# EAGLE schematic OPNpool r4 (EAGLE 9.6.2)
REV: 0.1
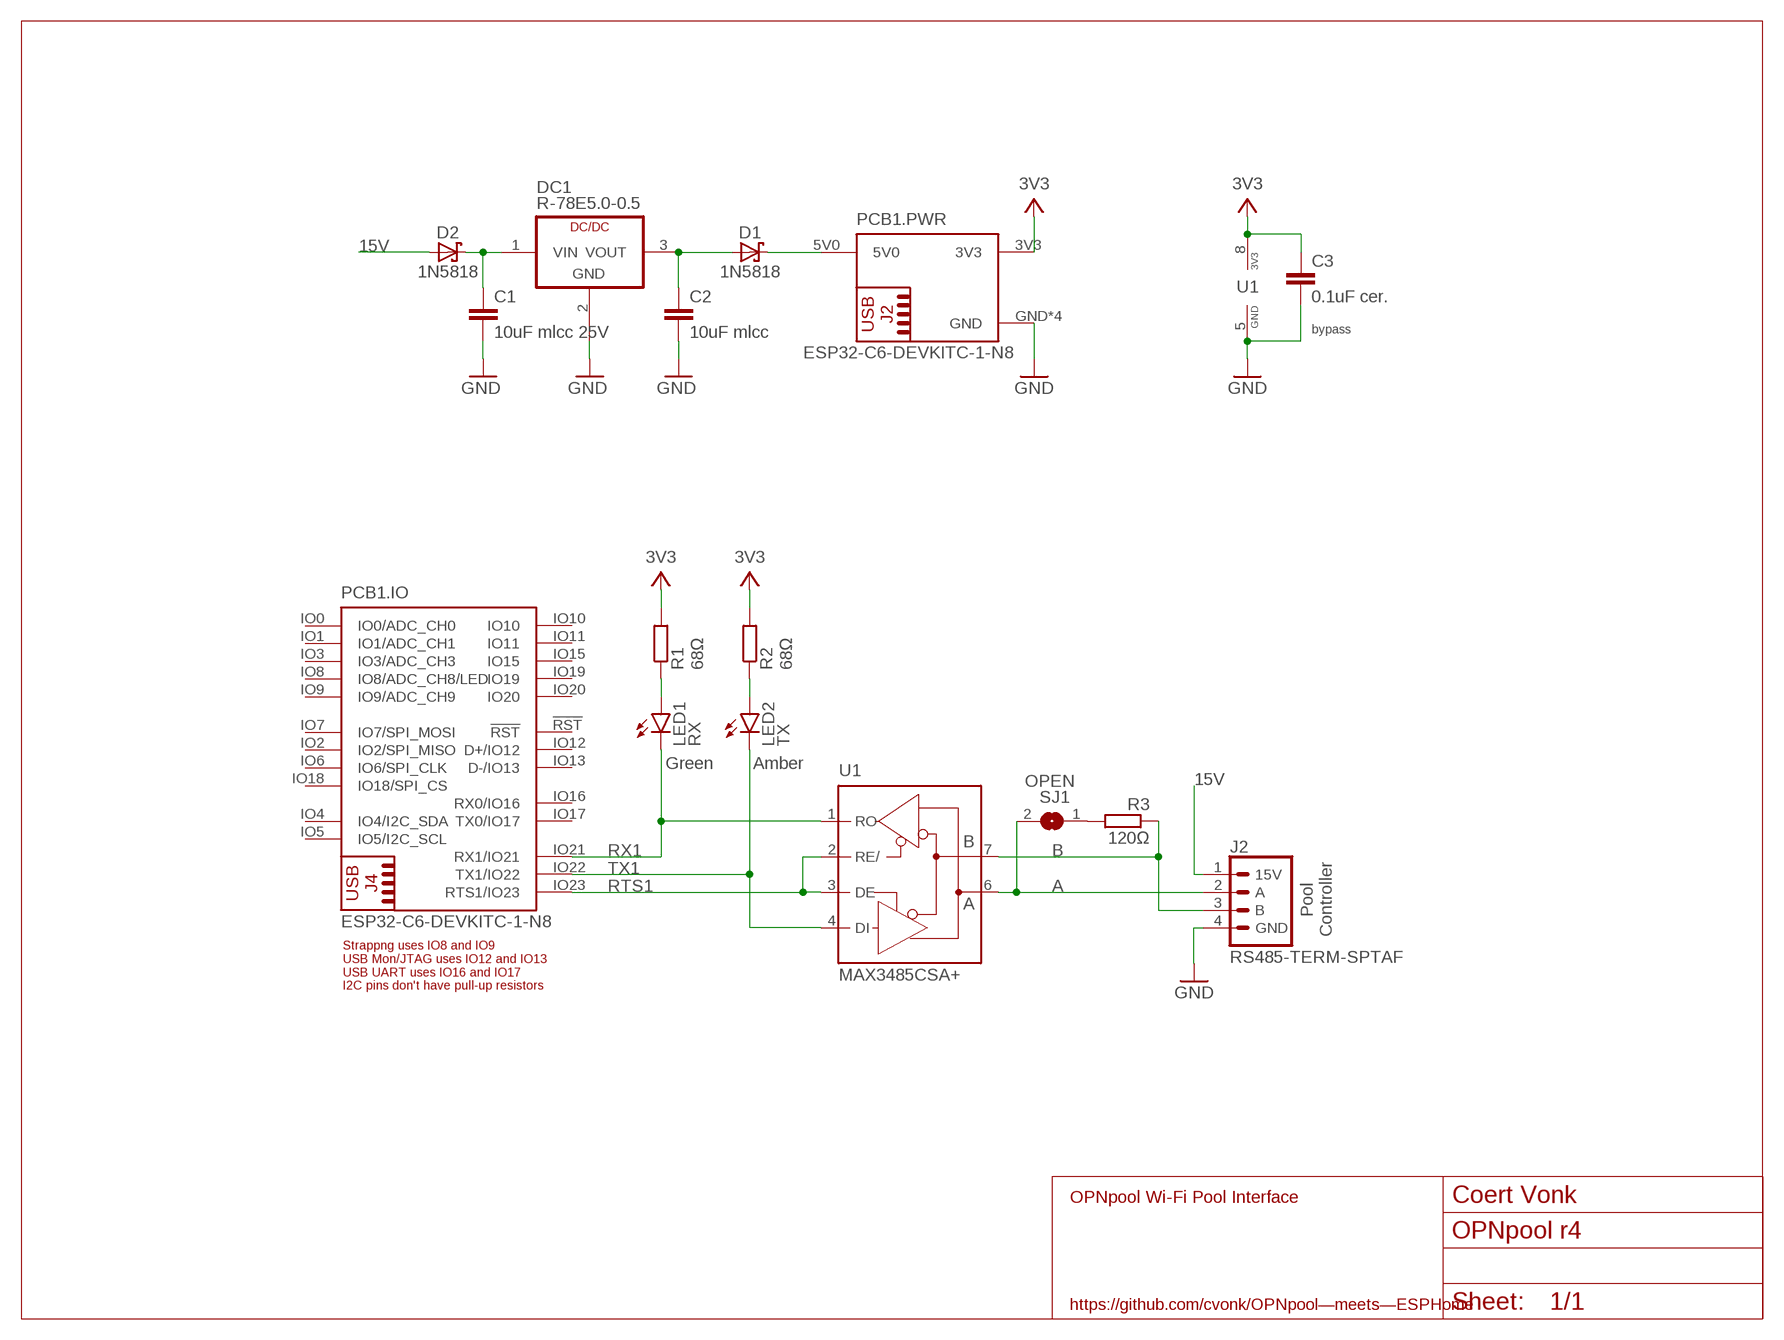
[diagram p0: schematic, sheet 1]
U$1 (FRAME_LETTER_L): AUTHOR_NAME: Coert Vonk; DESCRIPTION: OPNpool Wi-Fi Pool Interface; REV: 3; URL: https://github.com/cvonk/OPNpool—meets—ESPHome

## Parts
C1  10uF mlcc 25V  C-EUC0805K  [C0805K]
C2  10uF mlcc  C-EUC0805K  [C0805K]
C3  0.1uF cer.  C-EUC0805K  [C0805K]
D1  1N5818  [DO41-7.6]
D2  1N5818  [DO41-7.6]
DC1  R-78E5.0-0.5  [SIP3]
J2  RS485-TERM-SPTAF  [SPTAF1/4-5,0-LL]
LED1  RX  LEDCHIPLED_0805  [CHIPLED_0805]
LED2  TX  LEDCHIPLED_0805  [CHIPLED_0805]
PCB1  ESP32-C6-DEVKITC-1-N8  [MODULE_ESP32-C6-DEVKITC-1-N8]
R1  68Ω  R-EU_R0805  [R0805]
R2  68Ω  R-EU_R0805  [R0805]
R3  120Ω  R-EU_R0805  [R0805]
SJ1  OPEN  SJ  [SJ]
U1  MAX3485CSA+  [SO08]

## Nets
3V3: C3.1 PCB1.3V3(.PWR:3V3) R1.2 R2.2 U1.8(P:VCC)
15V: D2.A J2.1(15V)
A: J2.2(A) SJ1.2 U1.6(A)
B: J2.3(B) R3.1 U1.7(B)
GND: C1.2 C2.2 C3.2 DC1.2(GND) J2.4(GND) PCB1.GND(.PWR:GND) PCB1.GND@1(.PWR:GND) PCB1.GND@2(.PWR:GND) PCB1.GND@3(.PWR:GND) U1.5(P:GND)
N$1: LED1.A R1.1
N$2: LED2.A R2.1
N$4: D1.C PCB1.5V0(.PWR:5V0)
N$5: R3.2 SJ1.1
RTS1: PCB1.IO23(.IO:RTS1/IO23) U1.2(RE/) U1.3(DE)
RX1: LED1.C PCB1.IO21(.IO:RX1/IO21) U1.1(RO)
TX1: LED2.C PCB1.IO22(.IO:TX1/IO22) U1.4(DI)
VIN: C1.1 D2.C DC1.1(VIN)
VOUT: C2.1 D1.A DC1.3(VOUT)
Unconnected: PCB1.!RST(.IO:!RST) PCB1.IO0(.IO:IO0/ADC_CH0) PCB1.IO1(.IO:IO1/ADC_CH1) PCB1.IO2(.IO:IO2/SPI_MISO) PCB1.IO3(.IO:IO3/ADC_CH3) PCB1.IO4(.IO:IO4/I2C_SDA) PCB1.IO5(.IO:IO5/I2C_SCL) PCB1.IO6(.IO:IO6/SPI_CLK) PCB1.IO7(.IO:IO7/SPI_MOSI) PCB1.IO8(.IO:IO8/ADC_CH8/LED) PCB1.IO9(.IO:IO9/ADC_CH9) PCB1.IO10(.IO:IO10) PCB1.IO11(.IO:IO11) PCB1.IO12(.IO:D+/IO12) PCB1.IO13(.IO:D-/IO13) PCB1.IO15(.IO:IO15) PCB1.IO16(.IO:RX0/IO16) PCB1.IO17(.IO:TX0/IO17) PCB1.IO18(.IO:IO18/SPI_CS) PCB1.IO19(.IO:IO19) PCB1.IO20(.IO:IO20)

## Notes on the sheet
- bypass
- Green | Amber
- Pool
  Controller

## Library data of the parts
C1 C2 = rcl:C-EU: CAPACITOR, European symbol; MANF: Murata Electronics; MANF#: GJ821BR61E106KE11L; MOUSER#: 81-GJ821BR61E106KE1L; SPICEPREFIX: C
C3 = rcl:C-EU: CAPACITOR, European symbol; MANF: KEMET; MANF#: C0805C104K1RECAUTO; MOUSER#: 80-C0805C104K1REAUTO; SPICEPREFIX: C
D1 D2 = Coert Vonk:1N581*: 1.0A SCHOTTKY BARRIER RECTIFIER Source: http://www.diodes.com/datasheets/ds23001.pdf; MANF: Rectron; MANF#: 1N5818-T; MOUSER#: 583-1N5818-T
DC1 = Coert Vonk:R-78E*-0.5: DC/DC-Converter 5V 500 mA Technical specifications: Manufacturer: Recom Input Voltage: 7 - 28 V Output Voltage: 5 V Output Current: 500 mA Mfr.: R-78E5.0-0.5, data sheet <http://www.recom-power.com/pdf/Innoline/R-78Exx-0.5.pdf> Mouser: 919-R-78E5.0-0.5, abt. $2.70; MANF: RECOM Power; MANF#: R-78E5.0-0.5; MOUSER#: 919-R-78E5.0-0.5
J2 = Coert Vonk:RS485-TERM: SPTAF 1/ 4-5,0-LL - 1864451, PCB push terminal block Technical specifications: Manufacturer: Phoenix Contact Current Rating: 13.5 A Voltage Rating: 320 V Wire Gauge Range: 24 AWG to 18 AWG Mfr.#: 1864451 Mouser: 651-1864451, abt. $1.85; MANF: Phoenix Contact; MANF#: 1864451; MOUSER#: 651-1864451
LED1 LED2 = OPNpool:LED: LED OSRAM: - CHIPLED LG R971, LG N971, LY N971, LG Q971, LY Q971, LO R971, LY R971 LH N974, LH R974 LS Q976, LO Q976, LY Q976 LO Q996 - Hyper CHIPLED LW Q18S LB Q993, LB Q99A, LB R99A - SideLED LS A670, LO A670, LY A670, LG A670, LP A670 LB A673, LV A673, LT A673, LW A673 LH A674 LY A675 LS A676, LA A676, LO A676, LY A676, LW A676 LS A679, LY A679, LG A679 - Hyper Micro SIDELED® LS Y876, LA Y876, LO Y876, LY Y876 LT Y87S - SmartLED LW L88C, LW L88S LB L89C, LB L89S, LG L890 LS L89K, LO L89K, LY L89K LS L896, LA L896, LO L896, LY L896 - TOPLED LS T670, LO T670, LY T670, LG T670, LP T670 LSG T670, LSP T670, LSY T670, LOP T670, LYG T670 LG T671, LOG T671, LSG T671 LB T673, LV T673, LT T673, LW T673 LH T674 LS T676, LA T676, LO T676, LY T676, LB T676, LH T676, LSB T676, LW T676 LB T67C, LV T67C, LT T67C, LS T67K, LO T67K, LY T67K, LW E67C LS E67B, LA E67B, LO E67B, LY E67B, LB E67C, LV E67C, LT E67C LW T67C LS T679, LY T679, LG T679 LS T770, LO T770, LY T770, LG T770, LP T770 LB T773, LV T773, LT T773, LW T773 LH T774 LS E675, LA E675, LY E675, LS T675 LS T776, LA T776, LO T776, LY T776, LB T776 LHGB T686 LT T68C, LB T68C - Hyper Mini TOPLED® LB M676 - Mini TOPLED Santana® LG M470 LS M47K, LO M47K, LY M47K Source: http://www.osram.convergy.de LUXEON: - LUMILED® LXK2-PW12-R00, LXK2-PW12-S00, LXK2-PW14-U00, LXK2-PW14-V00 LXK2-PM12-R00, LXK2-PM12-S00, LXK2-PM14-U00 LXK2-PE12-Q00, LXK2-PE12-R00, LXK2-PE12-S00, LXK2-PE14-T00, LXK2-PE14-U00 LXK2-PB12-K00, LXK2-PB12-L00, LXK2-PB12-M00, LXK2-PB14-N00, LXK2-PB14-P00, LXK2-PB14-Q00 LXK2-PR12-L00, LXK2-PR12-M00, LXK2-PR14-Q00, LXK2-PR14-R00 LXK2-PD12-Q00, LXK2-PD12-R00, LXK2-PD12-S00 LXK2-PH12-R00, LXK2-PH12-S00 LXK2-PL12-P00, LXK2-PL12-Q00, LXK2-PL12-R00 Source: www.luxeon.com KINGBRIGHT: KA-3528ASYC Source: www.kingbright.com
PCB1 = Coert-Vonk:ESP32-C6-DEVKITC-1-N8: Footprint of Espresiff ESP32-C6-DevKitC-1-N8 (ESP32-C6-WROOM-1-N8 ) Technical specifications: Manufacturer: Espressif SoC: ESP32-C6-WROOM-1-N8, 32-bit RISC-V, max 160 MHz Connectivity: 2.4G Wi-Fi 6, Bluetooth 5.3 LE, Zigbee 3.0 and Thread 1.3 USB-C connectors: UART0 via CP2102, Serial/JTAG Memory: 8 MB Flash, 512 kB SRAM, 320 kB ROM Mfr.#: ESP32-C6-DevKitC-1-N8, data sheet <https://mm.digikey.com/Volume0/opasdata/d220001/medias/docus/5528/ESP32-C6-DEVKITC-1-N8.pdf>, documentation <https://docs.espressif.com/projects/esp-dev-kits/en/latest/esp32c6/esp32-c6-devkitc-1/user_guide.html>, reference <https://documentation.espressif.com/esp32-c6_technical_reference_manual_en.pdf> DigiKey: 1965-ESP32-C6-DEVKITC-1-N8-ND, about $9.00
R1-R3 = rcl:R-EU_: RESISTOR, European symbol; MANF: Bourns; MANF#: CRM0805-JW-1R5ELF; MOUSER#: 652-CRM0805JW1R5ELF; SPICEPREFIX: R
SJ1 = jumper:SJ: SMD solder JUMPER
U1 = Coert Vonk:MAX3485CSA+: RS-485 Transceiver 3.3V SMD Technical specifications: Manufacturer: Maxim Integrated Operating supply: 3.3 V, 1.1 mA Output: 3 V, 20 mA Data rate: 10 Mb/s Temperature range: 0 - 70 C Mfr.: R-78E5.0-0.5 Mouser: 919-R-78E5.0-0.5, abt. $2.70, details <https://www.mouser.com/ProductDetail/Maxim-Integrated/MAX3485CSA%2b>; MANF: Maxim Integrated; MANF#: MAX3485CSA+; MF: MAXIM; MOUSER#: 700-MAX3485CSA; MPN: MAX481CSA; OC_FARNELL: unknown; OC_NEWARK: 90C3817